# Altium schematic sheet DRAM Group.SchDoc
size 209 x 297 mm; Author: ALTIUM GOSTBOM2.0 KEV; SheetNumber: 5; SheetTotal: 48
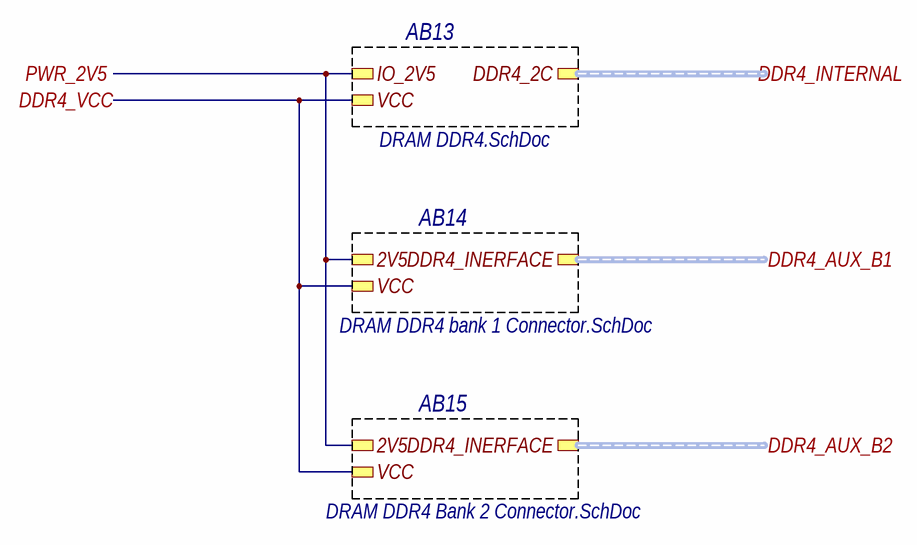
[diagram p0: DRAM Group.SchDoc]

## Sub-sheets
AB13 = DRAM DDR4.SchDoc: VCC, IO_2V5, DDR4_2C (harness DDR4_2C)
AB14 = DRAM DDR4 bank 1 Connector.SchDoc: VCC, DDR4_INERFACE (harness DDR4_SODIMM), 2V5
AB15 = DRAM DDR4 Bank 2 Connector.SchDoc: VCC, DDR4_INERFACE (harness DDR4_SODIMM), 2V5

## Ports
DDR4_AUX_B1 (harness DDR4_SODIMM), DDR4_AUX_B2 (harness DDR4_SODIMM), DDR4_INTERNAL (harness DDR4_2C), DDR4_VCC, PWR_2V5

## Nets
DDR4_VCC: port DDR4_VCC, sheet AB14/VCC, sheet AB13/VCC, sheet AB15/VCC
PWR_2V5: port PWR_2V5, sheet AB14/2V5, sheet AB13/IO_2V5, sheet AB15/2V5

## Buses and harness runs
harness port DDR4_AUX_B1 = sheet AB14/DDR4_INERFACE
harness port DDR4_AUX_B2 = sheet AB15/DDR4_INERFACE
harness port DDR4_INTERNAL = sheet AB13/DDR4_2C

## Notes on the sheet
- Подп. дата
- Инв. № дубл.
- Взам. инв. №
- Подп. и дата
- Инв. № подл.
- Изм.
- Лист
- № докум.
- Подп.
- Дата
- Файл:
- ALTIUM GOSTBOM2.0 KEV
- Копировал
- Формат А4